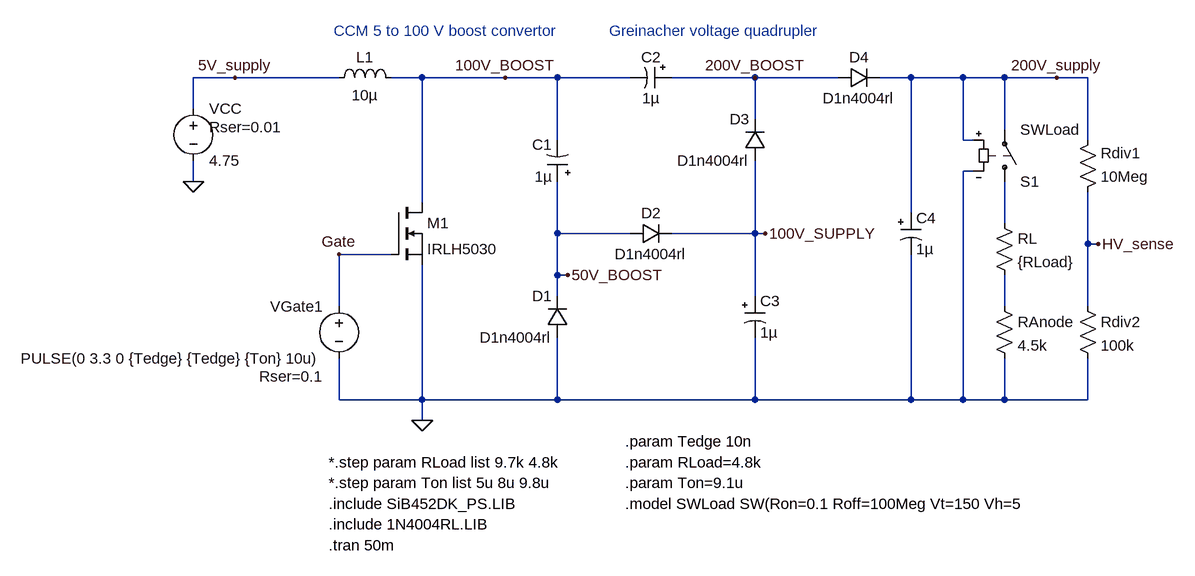
[diagram p0: schematic HV_supply.asc]
HV_supply.asc, the LTspice schematic file:
Version 4
SHEET 1 2108 1316
WIRE 96 -112 32 -112
WIRE 256 -112 96 -112
WIRE 384 -112 336 -112
WIRE 512 -112 384 -112
WIRE 592 -112 512 -112
WIRE 704 -112 592 -112
WIRE 896 -112 768 -112
WIRE 1024 -112 896 -112
WIRE 1136 -112 1088 -112
WIRE 1216 -112 1136 -112
WIRE 1280 -112 1216 -112
WIRE 1360 -112 1280 -112
WIRE 1408 -112 1360 -112
WIRE 32 -64 32 -112
WIRE 896 -48 896 -112
WIRE 1280 -32 1280 -112
WIRE 592 -16 592 -112
WIRE 1216 -16 1216 -112
WIRE 1232 -16 1216 -16
WIRE 1408 -16 1408 -112
WIRE 1232 32 1216 32
WIRE 32 48 32 16
WIRE 384 80 384 -112
WIRE 1136 96 1136 -112
WIRE 1280 112 1280 48
WIRE 592 128 592 48
WIRE 704 128 592 128
WIRE 896 128 896 16
WIRE 896 128 768 128
WIRE 912 128 896 128
WIRE 1408 144 1408 64
WIRE 1424 144 1408 144
WIRE 336 160 256 160
WIRE 592 192 592 128
WIRE 608 192 592 192
WIRE 592 224 592 192
WIRE 896 224 896 128
WIRE 256 240 256 160
WIRE 1280 240 1280 192
WIRE 1408 240 1408 144
WIRE 256 384 256 320
WIRE 384 384 384 176
WIRE 384 384 256 384
WIRE 592 384 592 288
WIRE 592 384 384 384
WIRE 896 384 896 288
WIRE 896 384 592 384
WIRE 1136 384 1136 160
WIRE 1136 384 896 384
WIRE 1216 384 1216 32
WIRE 1216 384 1136 384
WIRE 1280 384 1280 320
WIRE 1280 384 1216 384
WIRE 1408 384 1408 320
WIRE 1408 384 1280 384
WIRE 384 416 384 384
FLAG 384 416 0
FLAG 96 -112 5V_supply
FLAG 512 -112 100V_BOOST
FLAG 896 -112 200V_BOOST
FLAG 1424 144 HV_sense
FLAG 32 48 0
FLAG 1360 -112 200V_supply
FLAG 912 128 100V_SUPPLY
FLAG 608 192 50V_BOOST
FLAG 256 160 Gate
SYMBOL voltage 256 224 M0
WINDOW 123 0 0 Left 0
WINDOW 39 24 124 Left 2
SYMATTR SpiceLine Rser=0.1
SYMATTR InstName VGate1
SYMATTR Value PULSE(0 3.3 0 {Tedge} {Tedge} {Ton} 10u)
SYMBOL res 1392 80 M180
WINDOW 0 36 76 Left 2
WINDOW 3 36 40 Left 2
SYMATTR InstName Rdiv1
SYMATTR Value 10Meg
SYMBOL res 1392 224 R0
SYMATTR InstName Rdiv2
SYMATTR Value 100k
SYMBOL voltage 32 -80 R0
WINDOW 123 0 0 Left 0
WINDOW 39 24 44 Left 2
SYMATTR SpiceLine Rser=0.01
SYMATTR InstName VCC
SYMATTR Value 4.75
SYMBOL diode 608 288 R180
WINDOW 0 24 64 Left 2
WINDOW 3 24 0 Left 2
SYMATTR InstName D1
SYMATTR Value D1n4004rl
SYMBOL diode 704 144 R270
WINDOW 0 32 32 VTop 2
WINDOW 3 0 32 VBottom 2
SYMATTR InstName D2
SYMATTR Value D1n4004rl
SYMBOL diode 912 16 R180
WINDOW 0 24 64 Left 2
WINDOW 3 24 0 Left 2
SYMATTR InstName D3
SYMATTR Value D1n4004rl
SYMBOL diode 1024 -96 R270
WINDOW 0 32 32 VTop 2
WINDOW 3 0 32 VBottom 2
SYMATTR InstName D4
SYMATTR Value D1n4004rl
SYMBOL res 1264 224 R0
SYMATTR InstName RAnode
SYMATTR Value 4.5k
SYMBOL polcap 608 48 R180
WINDOW 0 24 57 Left 2
WINDOW 3 24 8 Left 2
SYMATTR InstName C1
SYMATTR Value 1µ
SYMATTR SpiceLine V=250
SYMBOL polcap 768 -128 R90
WINDOW 0 0 32 VBottom 2
WINDOW 3 32 32 VTop 2
SYMATTR InstName C2
SYMATTR Value 1µ
SYMATTR SpiceLine V=250
SYMBOL polcap 880 224 R0
SYMATTR InstName C3
SYMATTR Value 1µ
SYMATTR SpiceLine V=250
SYMBOL polcap 1120 96 R0
SYMATTR InstName C4
SYMATTR Value 1µ
SYMATTR SpiceLine V=250
SYMBOL sw 1280 64 M180
SYMATTR InstName S1
SYMATTR Value SWLoad
SYMBOL res 1264 96 R0
SYMATTR InstName RL
SYMATTR Value {RLoad}
SYMBOL ind 240 -96 R270
WINDOW 0 32 56 VTop 2
WINDOW 3 5 56 VBottom 2
SYMATTR InstName L1
SYMATTR Value 10µ
SYMATTR SpiceLine Ipk=6 Rser=0.0195 Rpar=37085.5 Cpar=2.373p
SYMBOL nmos 336 80 R0
SYMATTR InstName M1
SYMATTR Value IRLH5030
TEXT 240 608 Left 2 !.tran 50m
TEXT 240 576 Left 2 !.include 1N4004RL.LIB
TEXT 240 512 Left 2 !*.step param Ton list 5u 8u 9.8u
TEXT 672 -184 Left 2 ;Greinacher voltage quadrupler
TEXT 248 -184 Left 2 ;CCM 5 to 100 V boost convertor
TEXT 240 544 Left 2 !.include SiB452DK_PS.LIB
TEXT 696 512 Left 2 !.param Ton=9.1u
TEXT 696 544 Left 2 !.model SWLoad SW(Ron=0.1 Roff=100Meg Vt=150 Vh=5
TEXT 696 480 Left 2 !.param RLoad=4.8k
TEXT 240 480 Left 2 !*.step param RLoad list 9.7k 4.8k
TEXT 696 448 Left 2 !.param Tedge 10n

The netlist it stands for:
* HV_supply.asc
VGate1 Gate 0 PULSE(0 3.3 0 {Tedge} {Tedge} {Ton} 10u) Rser=0.1
Rdiv1 HV_sense 200V_supply 10Meg
Rdiv2 HV_sense 0 100k
VCC 5V_supply 0 4.75 Rser=0.01
D1 0 50V_BOOST D1n4004rl
D2 50V_BOOST 100V_SUPPLY D1n4004rl
D3 100V_SUPPLY 200V_BOOST D1n4004rl
D4 200V_BOOST 200V_supply D1n4004rl
RAnode N002 0 4.5k
C1 50V_BOOST 100V_BOOST 1µ V=250
C2 200V_BOOST 100V_BOOST 1µ V=250
C3 100V_SUPPLY 0 1µ V=250
C4 200V_supply 0 1µ V=250
S1 N001 200V_supply 200V_supply 0 SWLoad
RL N001 N002 {RLoad}
L1 5V_supply 100V_BOOST 10µ Ipk=6 Rser=0.0195 Rpar=37085.5 Cpar=2.373p
M1 100V_BOOST Gate 0 0 IRLH5030
.model D D
.lib standard.dio
.model NMOS NMOS
.model PMOS PMOS
.lib standard.mos
.tran 50m
.include 1N4004RL.LIB
*.step param Ton list 5u 8u 9.8u
* Greinacher voltage quadrupler
* CCM 5 to 100 V boost convertor
.include SiB452DK_PS.LIB
.param Ton=9.1u
.model SWLoad SW(Ron=0.1 Roff=100Meg Vt=150 Vh=5
.param RLoad=4.8k
*.step param RLoad list 9.7k 4.8k
.param Tedge 10n
.backanno
.end